# EAGLE design Mirrors_Controls (EAGLE 9.6.2)
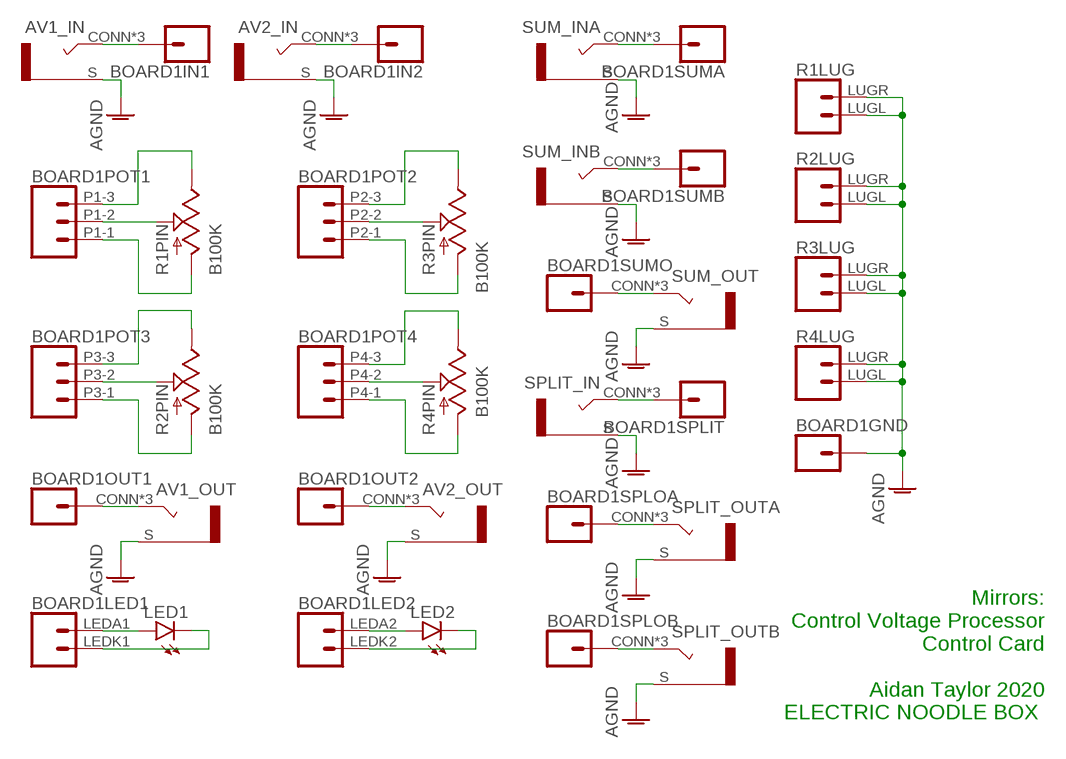
[diagram p0: schematic, sheet 1]

## Parts
AV1_IN  COMBI-JACKCINCHNANA  [NEWCOMBOJACK_PANEL]
AV1_OUT  COMBI-JACKCINCHNANA  [NEWCOMBOJACK_PANEL]
AV2_IN  COMBI-JACKCINCHNANA  [NEWCOMBOJACK_PANEL]
AV2_OUT  COMBI-JACKCINCHNANA  [NEWCOMBOJACK_PANEL]
BOARD1  MIRRORS_LINK  [MIRRORS]
LED1  LED5MM  [LED5MM]
LED2  LED5MM  [LED5MM]
R1  B100K  POTENTIOMETER  [ALPHA_RV09_9MMPOT]
R2  B100K  POTENTIOMETER  [ALPHA_RV09_9MMPOT]
R3  B100K  POTENTIOMETER  [ALPHA_RV09_9MMPOT]
R4  B100K  POTENTIOMETER  [ALPHA_RV09_9MMPOT]
SPLIT_IN  COMBI-JACKCINCHNANA  [NEWCOMBOJACK_PANEL]
SPLIT_OUTA  COMBI-JACKCINCHNANA  [NEWCOMBOJACK_PANEL]
SPLIT_OUTB  COMBI-JACKCINCHNANA  [NEWCOMBOJACK_PANEL]
SUM_INA  COMBI-JACKCINCHNANA  [NEWCOMBOJACK_PANEL]
SUM_INB  COMBI-JACKCINCHNANA  [NEWCOMBOJACK_PANEL]
SUM_OUT  COMBI-JACKCINCHNANA  [NEWCOMBOJACK_PANEL]

## Nets
AGND: AV1_IN.S AV1_OUT.S AV2_IN.S AV2_OUT.S BOARD1.GND R1.LUGL R1.LUGR R2.LUGL R2.LUGR R3.LUGL R3.LUGR R4.LUGL R4.LUGR SPLIT_IN.S SPLIT_OUTA.S SPLIT_OUTB.S SUM_INA.S SUM_INB.S SUM_OUT.S
N$1: AV1_IN.CONN(T) AV1_IN.T1(T) AV1_IN.T2(T) BOARD1.IN1
N$2: BOARD1.P1-3 R1.C3(PIN:B)
N$3: BOARD1.P1-2 R1.C2(PIN:W)
N$4: BOARD1.P1-1 R1.C1(PIN:A)
N$5: BOARD1.P3-3 R2.C3(PIN:B)
N$6: BOARD1.P3-2 R2.C2(PIN:W)
N$7: BOARD1.P3-1 R2.C1(PIN:A)
N$8: AV1_OUT.CONN(T) AV1_OUT.T1(T) AV1_OUT.T2(T) BOARD1.OUT1
N$9: BOARD1.LEDA1 LED1.A
N$10: BOARD1.LEDK1 LED1.K(C)
N$11: AV2_IN.CONN(T) AV2_IN.T1(T) AV2_IN.T2(T) BOARD1.IN2
N$12: BOARD1.P2-3 R3.C3(PIN:B)
N$13: BOARD1.P2-2 R3.C2(PIN:W)
N$14: BOARD1.P2-1 R3.C1(PIN:A)
N$15: BOARD1.P4-2 R4.C2(PIN:W)
N$16: BOARD1.P4-3 R4.C3(PIN:B)
N$17: BOARD1.P4-1 R4.C1(PIN:A)
N$18: AV2_OUT.CONN(T) AV2_OUT.T1(T) AV2_OUT.T2(T) BOARD1.OUT2
N$19: BOARD1.LEDA2 LED2.A
N$20: BOARD1.LEDK2 LED2.K(C)
N$21: BOARD1.SUMA SUM_INA.CONN(T) SUM_INA.T1(T) SUM_INA.T2(T)
N$22: BOARD1.SUMB SUM_INB.CONN(T) SUM_INB.T1(T) SUM_INB.T2(T)
N$23: BOARD1.SUMO SUM_OUT.CONN(T) SUM_OUT.T1(T) SUM_OUT.T2(T)
N$24: BOARD1.SPLIT SPLIT_IN.CONN(T) SPLIT_IN.T1(T) SPLIT_IN.T2(T)
N$25: BOARD1.SPLOA SPLIT_OUTA.CONN(T) SPLIT_OUTA.T1(T) SPLIT_OUTA.T2(T)
N$26: BOARD1.SPLOB SPLIT_OUTB.CONN(T) SPLIT_OUTB.T1(T) SPLIT_OUTB.T2(T)

## Notes on the sheet
- Mirrors:
  Control Voltage Processor
  Control Card
  
  Aidan Taylor 2020
  ELECTRIC NOODLE BOX

## Library data of the parts
AV1_IN AV1_OUT AV2_IN AV2_OUT SPLIT_IN SPLIT_OUTA SPLIT_OUTB SUM_INA SUM_INB SUM_OUT = ElectricNoodleBox:COMBI-JACK
BOARD1 = ElectricNoodleBox:MIRRORS_LINK
LED1 LED2 = led:LED: LED OSRAM: - CHIPLED LG R971, LG N971, LY N971, LG Q971, LY Q971, LO R971, LY R971 LH N974, LH R974 LS Q976, LO Q976, LY Q976 LO Q996 - Hyper CHIPLED LW Q18S LB Q993, LB Q99A, LB R99A - SideLED LS A670, LO A670, LY A670, LG A670, LP A670 LB A673, LV A673, LT A673, LW A673 LH A674 LY A675 LS A676, LA A676, LO A676, LY A676, LW A676 LS A679, LY A679, LG A679 - Hyper Micro SIDELED® LS Y876, LA Y876, LO Y876, LY Y876 LT Y87S - SmartLED LW L88C, LW L88S LB L89C, LB L89S, LG L890 LS L89K, LO L89K, LY L89K LS L896, LA L896, LO L896, LY L896 - TOPLED LS T670, LO T670, LY T670, LG T670, LP T670 LSG T670, LSP T670, LSY T670, LOP T670, LYG T670 LG T671, LOG T671, LSG T671 LB T673, LV T673, LT T673, LW T673 LH T674 LS T676, LA T676, LO T676, LY T676, LB T676, LH T676, LSB T676, LW T676 LB T67C, LV T67C, LT T67C, LS T67K, LO T67K, LY T67K, LW E67C LS E67B, LA E67B, LO E67B, LY E67B, LB E67C, LV E67C, LT E67C LW T67C LS T679, LY T679, LG T679 LS T770, LO T770, LY T770, LG T770, LP T770 LB T773, LV T773, LT T773, LW T773 LH T774 LS E675, LA E675, LY E675, LS T675 LS T776, LA T776, LO T776, LY T776, LB T776 LHGB T686 LT T68C, LB T68C - Hyper Mini TOPLED® LB M676 - Mini TOPLED Santana® LG M470 LS M47K, LO M47K, LY M47K Source: http://www.osram.convergy.de LUXEON: - LUMILED® LXK2-PW12-R00, LXK2-PW12-S00, LXK2-PW14-U00, LXK2-PW14-V00 LXK2-PM12-R00, LXK2-PM12-S00, LXK2-PM14-U00 LXK2-PE12-Q00, LXK2-PE12-R00, LXK2-PE12-S00, LXK2-PE14-T00, LXK2-PE14-U00 LXK2-PB12-K00, LXK2-PB12-L00, LXK2-PB12-M00, LXK2-PB14-N00, LXK2-PB14-P00, LXK2-PB14-Q00 LXK2-PR12-L00, LXK2-PR12-M00, LXK2-PR14-Q00, LXK2-PR14-R00 LXK2-PD12-Q00, LXK2-PD12-R00, LXK2-PD12-S00 LXK2-PH12-R00, LXK2-PH12-S00 LXK2-PL12-P00, LXK2-PL12-Q00, LXK2-PL12-R00 Source: www.luxeon.com KINGBRIGHT: KA-3528ASYC Source: www.kingbright.com
R1-R4 = ElectricNoodleBox:POTENTIOMETER

## Board
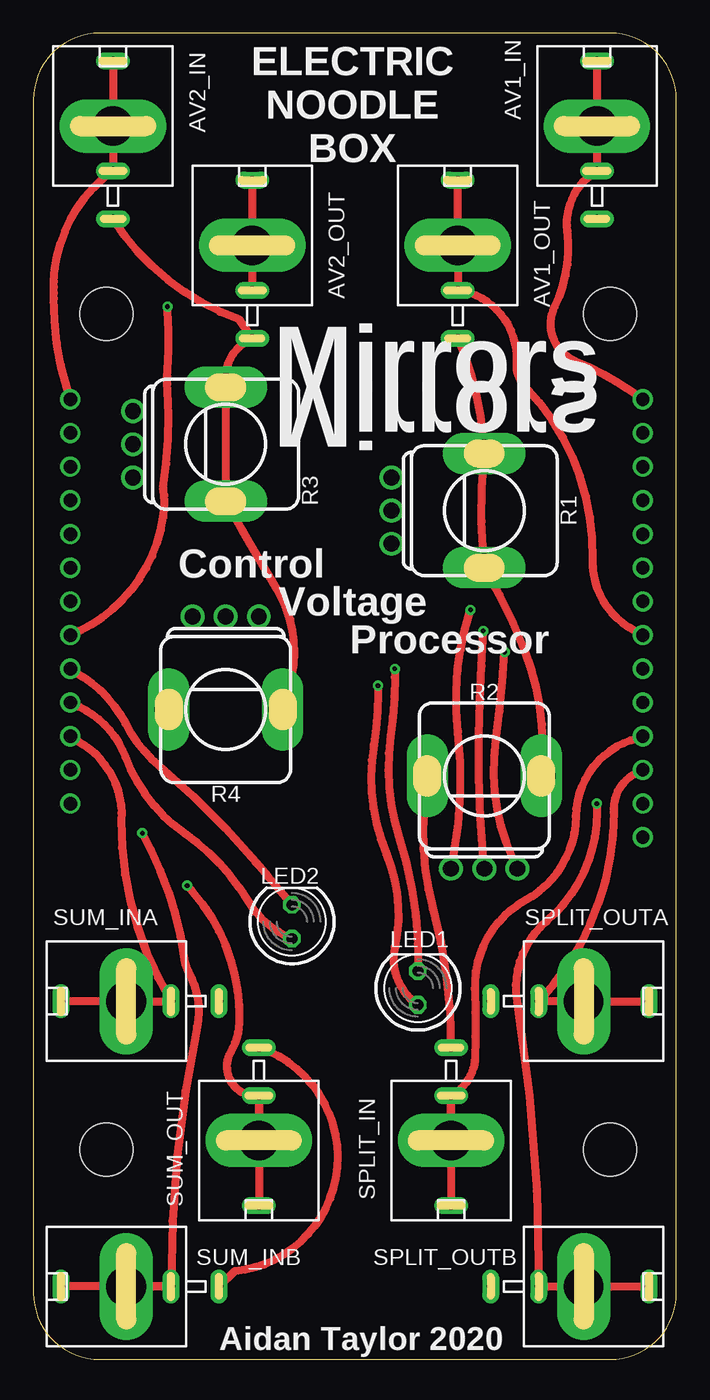
[diagram p1: board, top side]
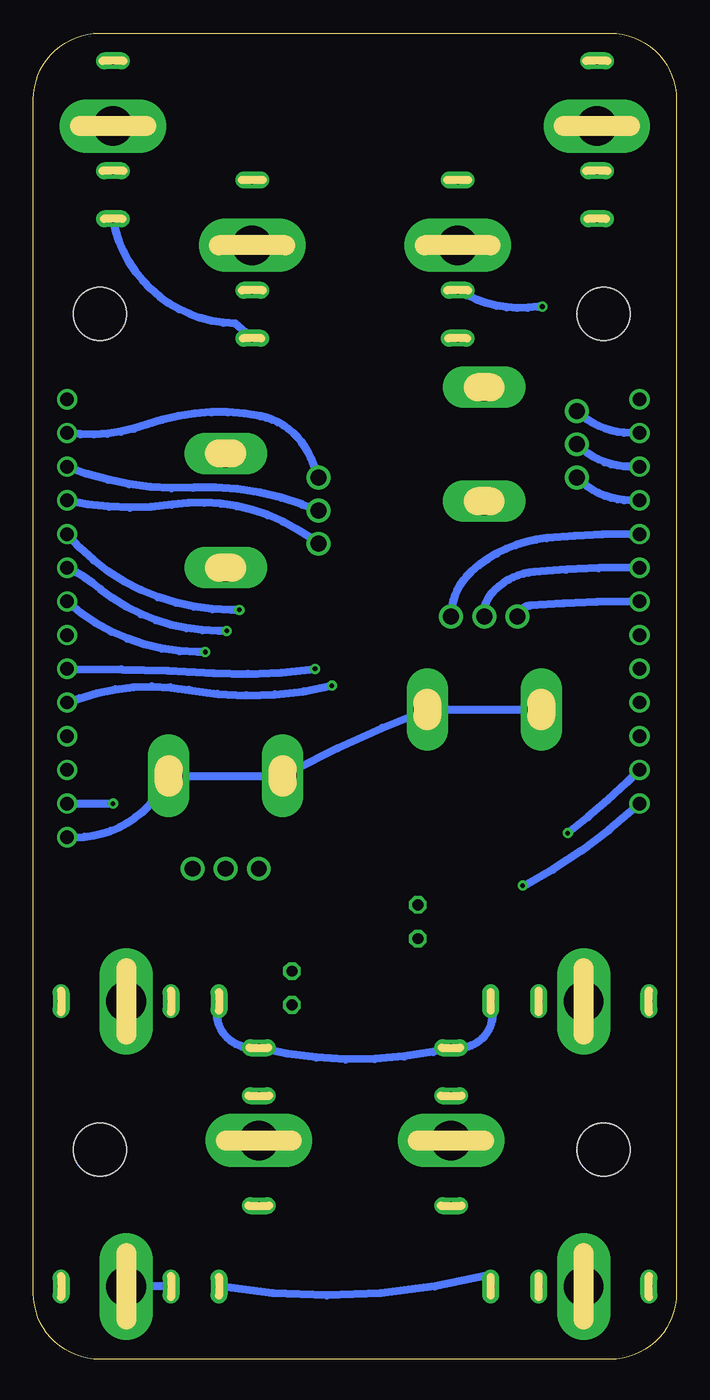
[diagram p2: board, bottom side, seen from below]

Size 48.5 x 100 mm. Coordinates in mm from the lower left corner, seen from the top.
Outline: 48.5,5 48.5,95 arc90 43.5,100 5,100 arc90 0,95 0,5 arc90 5,0 43.5,0 arc90 48.5,5
Copper layers (1*16): Top 0.035mm / dielectric 1.5mm / Bottom 0.035mm
Design rules "default": minimum track width 6mil, minimum drill 0.35mm, track to track 6mil, track to pad 6mil, pad to pad 6mil, via to via 6mil, smd to smd 6mil, copper to edge 40mil, drill to drill 6mil, minimum pad ring 10mil, minimum via ring 8mil, stop-mask expansion 4mil, vias tented up to drill 0mil, thermal gap 10mil

### Footprints (pad centres in the part's own frame; a part is rotated, then mirrored left to right if it is on the bottom)
NEWCOMBOJACK_PANEL = drill 3 pad 3.6 long: CONN 0,0 | drill 0.6 pad 1.27 long: S 0,-7; T1 0,4.92; T2 0,-3.38
MIRRORS = drill 1.016: GND 44.45,2.54; IN1 11.43,2.54; IN2 11.43,45.72; LEDA1 34.29,2.54; LEDA2 34.29,45.72; LEDK1 31.75,2.54; LEDK2 31.75,45.72; OUT1 29.21,2.54; OUT2 29.21,45.72; P1-1 13.97,2.54; P1-2 16.51,2.54; P1-3 19.05,2.54; P2-1 13.97,45.72; P2-2 16.51,45.72; P2-3 19.05,45.72; P3-1 21.59,2.54; P3-2 24.13,2.54; P3-3 26.67,2.54; P4-1 21.59,45.72; P4-2 24.13,45.72; P4-3 26.67,45.72; SPLIT 36.83,2.54; SPLOA 39.37,2.54; SPLOB 41.91,2.54; SUMA 36.83,45.72; SUMB 39.37,45.72; SUMO 41.91,45.72 | hole 4: 5,5; 68,5; 5,43; 68,43
LED5MM = drill 0.813 octagon: A -1.27,0; K 1.27,0
ALPHA_RV09_9MMPOT = drill 1.2 pad 1.778: C1 -2.5,-7; C2 0,-7; C3 2.5,-7 | drill 2.1 pad 2.8 long: LUGL -4.3,0; LUGR 4.3,0

### Placement (x,y rotation side)
AV1_IN  42.5,93 0 top
AV1_OUT  32,84 0 top
AV2_IN  6,93 0 top
AV2_OUT  16.5,84 0 top
BOARD1  48.5,83.82 270 bottom
LED1  29,28 90 top
LED2  19.5,33 90 top
R1  34,64 270 top
R2  34,44 0 top
R3  14.5,69 270 top
R4  14.5,49 180 top
SPLIT_IN  31.5,16.5 180 top
SPLIT_OUTA  41.5,27 270 top
SPLIT_OUTB  41.5,5.5 270 top
SUM_INA  7,27 90 top
SUM_INB  7,5.5 90 top
SUM_OUT  17,16.5 180 top

### Tracks (layer width: path | path; a pad name or v marks a point on that pad's centre or on a via)
AGND
  Top 0.61: R2.LUGR 38.37,45.09 arc25 37.1,53.34 arc10 R1.LUGR 33.92,60.64 arc-10 R1.LUGL 33.92,69.53 arc19 AV1_OUT.S | R4.LUGL 19.32,50.8 arc47 18.37,58.1 arc-1 R3.LUGR R3.LUGL 14.56,74.61 arc-55 AV2_OUT.S 15.51,78.42 arc-38 AV2_IN.S | R2.LUGL 29.48,41.59 arc20 30.11,33.97 arc-15 SPLIT_IN.S | SUM_INB.S 15.19,6.67 arc74 22.81,13.65 arc82 SUM_OUT.S
  Bottom 0.61: BOARD1.GND 45.35,39.37 arc-67 R2.LUGR R2.LUGL 28.84,44.45 arc7 R4.LUGL R4.LUGR | AV1_OUT.S 33.29,78.11 arc79 AV1_IN.S | SUM_INB.S 14.24,6.35 arc24 SPLIT_OUTB.S | SPLIT_OUTA.S arc-111 32.02,23.5 SPLIT_IN.S arc-25 18.37,23.18 SUM_OUT.S 16.46,23.5 arc-111 SUM_INA.S
N$1
  Top 0.61: BOARD1.IN1 45.04,73.03 arc12 40.91,75.25 arc-94 39.32,79.38 arc33 40.27,85.09 arc-66 AV1_IN.T2 AV1_IN.CONN AV1_IN.T1
N$2
  Bottom 0.61: R1.C3 27.57,61.91 arc-44 38.05,64.45 arc21 BOARD1.P1-3
N$3
  Bottom 0.61: R1.C2 28.21,64.45 arc-24 36.47,65.72 arc25 BOARD1.P1-2
N$4
  Bottom 0.61: R1.C1 27.57,67.94 arc-57 31.38,71.12 arc-31 39.96,70.48 arc27 BOARD1.P1-1
N$5  (via drill 0.35)
  Top 0.61: R2.C3 36.15,37.78 arc-32 34.88,46.67 arc5 35.51,53.34 arc-185 v35.54,53.34
  Bottom 0.61: v35.54,53.34 36.15,53.34 arc42 BOARD1.P3-3
N$6  (via drill 0.35)
  Top 0.61: R2.C2 33.92,37.78 arc-7 33.61,46.99 arc-2 v33.92,54.93
  Bottom 0.61: v33.92,54.93 34.56,54.93 arc39 43.45,58.1 arc-14 BOARD1.P3-2
N$7  (via drill 0.35)
  Top 0.61: R2.C1 31.7,38.1 arc17 32.02,47.31 arc-25 v32.97,56.52
  Bottom 0.61: v32.97,56.52 33.61,56.52 arc50 BOARD1.P3-1
N$8
  Top 0.61: BOARD1.OUT1 45.35,54.93 arc-64 42.18,60.33 arc45 37.1,73.34 arc-51 36.47,75.25 arc84 AV1_OUT.T2 AV1_OUT.CONN AV1_OUT.T1
N$9  (via drill 0.35)
  Top 0.61: v25.99,50.8 25.99,50.16 arc-10 25.67,46.35 arc32 26.62,38.1 arc-35 27.26,31.11 arc68 LED1.A
  Bottom 0.61: BOARD1.LEDA1 45.04,49.85 arc29 36.78,50.48 arc-24 v25.99,50.8
N$10  (via drill 0.35)
  Top 0.61: v27.26,52.07 27.26,51.44 arc-8 26.94,46.99 arc26 27.57,39.37 arc-19 LED1.K
  Bottom 0.61: BOARD1.LEDK1 45.35,52.07 arc3 34.88,51.75 arc-12 v27.26,52.07
N$11
  Top 0.61: BOARD1.IN2 2.49,73.34 arc-17 1.54,80.01 arc1 1.54,81.28 arc-52 AV2_IN.T2 AV2_IN.CONN AV2_IN.T1
N$12
  Bottom 0.61: BOARD1.P2-3 3.45,64.77 arc46 R3.C3
N$13
  Bottom 0.61: BOARD1.P2-2 3.45,67.31 arc45 R3.C2
N$14
  Bottom 0.61: BOARD1.P2-1 3.45,69.85 arc44 R3.C1
N$15
  Bottom 0.61: BOARD1.P4-2 3.45,59.69 arc-5 10.75,59.37 arc-43 13.92,57.78 arc-48 R4.C2
N$16
  Bottom 0.61: BOARD1.P4-3 3.45,57.15 arc-5 11.06,56.83 arc-74 R4.C3
N$17
  Bottom 0.61: BOARD1.P4-1 3.45,62.23 arc-6 9.79,61.91 arc-36 15.51,59.37 arc-48 R4.C1
N$18  (via drill 0.35)
  Top 0.61: BOARD1.OUT2 3.45,54.93 arc56 9.79,63.5 arc17 9.79,65.72 arc13 10.11,73.03 arc-8 10.11,74.61 arc8 10.11,79.06 arc-8 v10.11,79.38 | AV2_OUT.T2 AV2_OUT.CONN AV2_OUT.T1
  Bottom 0.61: v10.11,79.38 10.43,79.38 arc41 AV2_OUT.T2
N$19
  Top 0.61: BOARD1.LEDA2 3.45,49.21 arc-44 6.94,45.4 arc35 11.38,39.69 arc-24 16.14,34.61 arc37 LED2.A
N$20
  Top 0.61: BOARD1.LEDK2 3.76,51.44 arc-30 6.94,47.94 arc22 9.48,44.77 arc-10 16.78,37.47 arc1 LED2.K
N$21
  Top 0.61: BOARD1.SUMA 3.76,46.35 arc-61 6.62,40.64 arc32 SUM_INA.T2 SUM_INA.CONN SUM_INA.T1
N$22  (via drill 0.35)
  Top 0.61: v8.21,39.69 8.84,38.42 arc-19 11.38,30.16 arc22 11.7,29.21 arc-41 12.34,25.08 arc12 SUM_INB.T2 | SUM_INB.T2 SUM_INB.T1 | SUM_INB.CONN SUM_INB.T2
  Bottom 0.61: BOARD1.SUMB 3.76,43.5 arc7 v8.21,39.69
N$23  (via drill 0.35)
  Top 0.61: SUM_OUT.T2 SUM_OUT.T1 | SUM_OUT.CONN SUM_OUT.T2 | v11.6,35.73 12.02,35.24 arc-43 15.51,25.4 arc-28 14.88,23.18 arc125 SUM_OUT.T2
  Bottom 0.61: BOARD1.SUMO 3.13,41.59 arc15 11.55,35.66 arc-195 v11.6,35.73
N$24
  Top 0.61: BOARD1.SPLIT 45.04,46.67 arc70 40.91,40.96 arc-61 37.1,34.61 arc63 33.29,27.94 arc-4 33.29,22.54 arc-55 SPLIT_IN.T2 | SPLIT_IN.T2 SPLIT_IN.T1 | SPLIT_IN.CONN SPLIT_IN.T2
N$25
  Top 0.61: BOARD1.SPLOA 45.35,44.13 arc67 43.77,41.27 arc-44 SPLIT_OUTA.T2 SPLIT_OUTA.CONN SPLIT_OUTA.T1
N$26  (via drill 0.35)
  Top 0.61: v42.5,41.91 42.5,41.27 arc-50 38.69,33.02 arc59 36.47,26.99 arc-9 SPLIT_OUTB.T2 SPLIT_OUTB.T1
  Bottom 0.61: BOARD1.SPLOB v42.5,41.91 | SPLIT_OUTB.T2 SPLIT_OUTB.CONN

### Text on the board
tPlace: ELECTRIC / NOODLE / BOX | Mirrors | Mirrors | Control | Voltage | Processor | Aidan Taylor 2020